# Altium schematic sheet 1_P1.schdoc
size 429 x 307 mm; Symbol: Drawing-Symbol_A4; Device: Drawing-Symbol_A4; Company: 嘉立创EDA; Version: V1.0; Page Size: A4; @Project Name: 最小系统版stm32f103; @Page Count: 1; @Update Date: 2025-07-18; @Create Date: 2025-07-12; @Schematic Name: Schematic1; @Page No: 1; @Page Name: P1; @Create Time: 23:24:22; @Update Time: 00:52:15; Width: 1655; Height: 1170; Region Start: 1; X Region Count: 6; Y Region Count: 4; Blade Width: 10; Title Block Position: 3; @Board Name: Board1; SheetNumber: 1; SheetTotal: 1
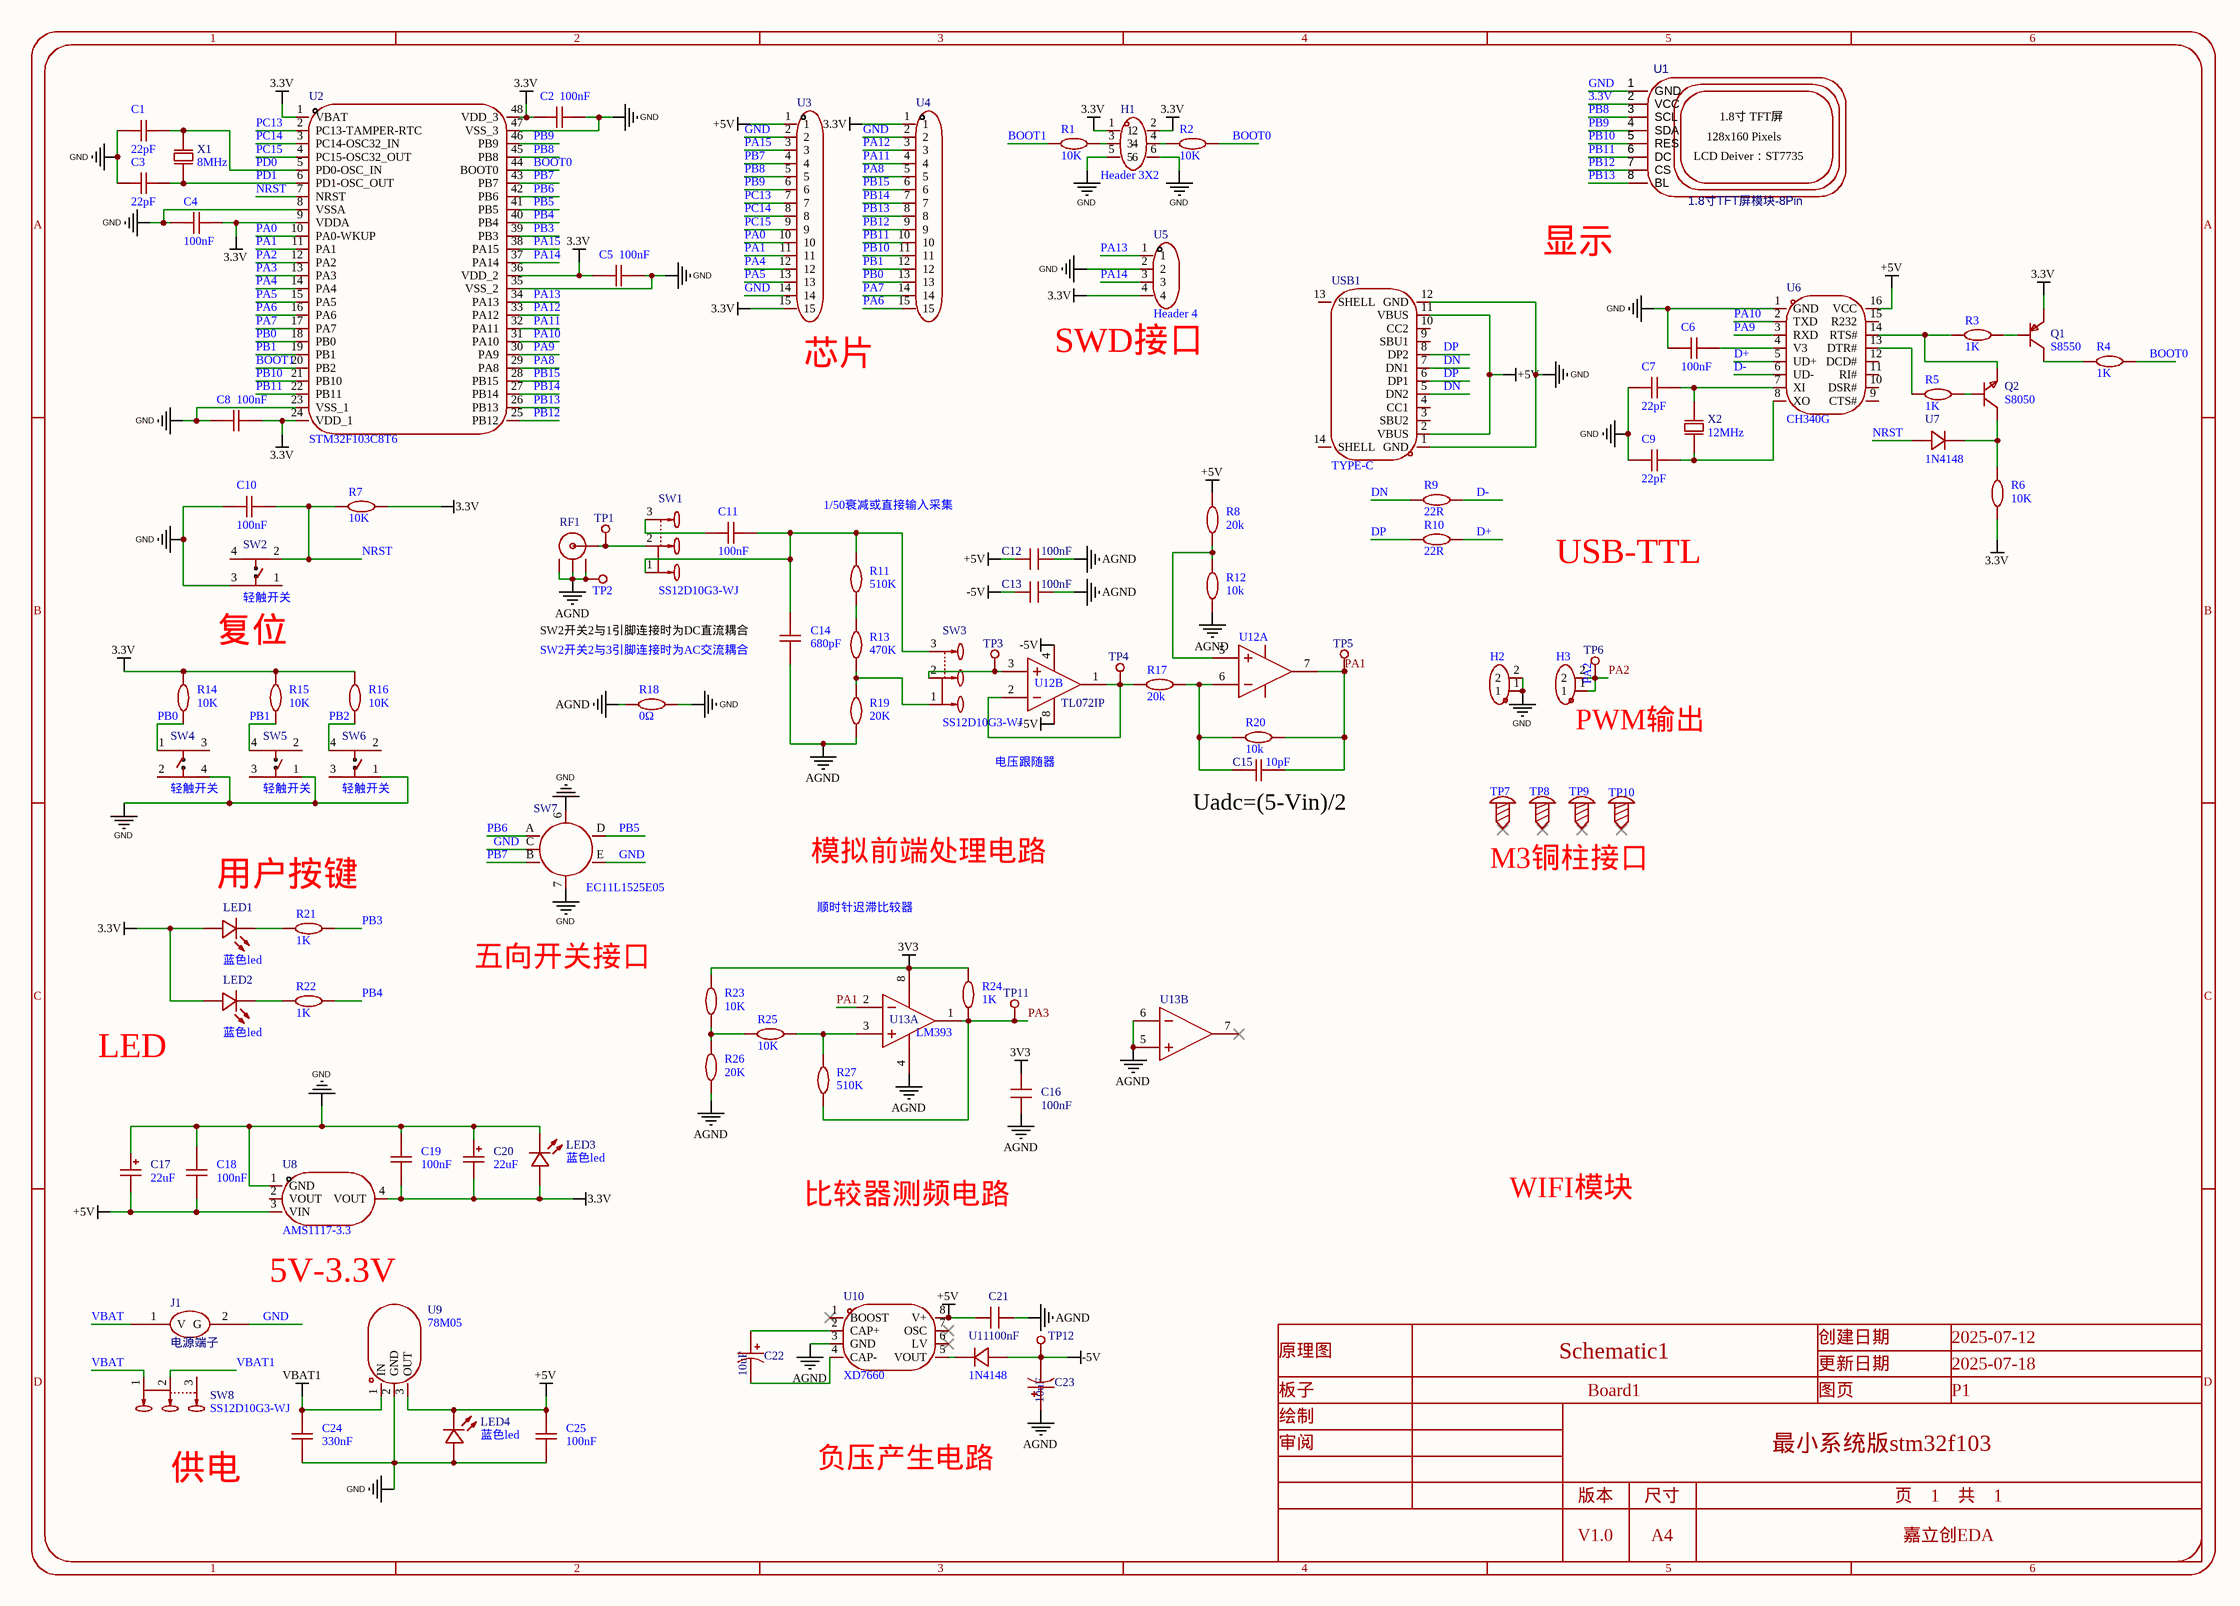
[diagram p0: 1_P1.schdoc]

## Parts
C1  22pF  [C0603]
C2  100nF  [C0603]
C3  22pF  [C0603]
C4  100nF  [C0603]
C5  100nF  [C0603]
C6  100nF  [C0603]
C7  22pF  [C0603]
C8  100nF  [C0603]
C9  22pF  [C0603]
C10  100nF  [C0603]
C11  100nF  [C0603]
C12  100nF  [C0603]
C13  100nF  [C0603]
C14  680pF  [C0603]
C15  10pF  [C0603]
C16  100nF  [C0603]
C17  22uF  [CAP-SMD_L2.0-W1.3-FD]
C18  100nF  [C0603]
C19  100nF  [C0603]
C20  22uF  [CAP-SMD_L2.0-W1.3-FD]
C21  100nF  [C0603]
C22  10uF  [CAP-SMD_L2.1-W1.4-FD]
C23  10uF  [CAP-SMD_L2.1-W1.4-FD]
C24  330nF  [C0603]
C25  100nF  [C0603]
H1  Header 3X2  [HDR-TH_6P-P2.54-V-M-R2-C3-S2.54]
H2  (no value)  [HDR-TH_2P-P2.54-V-M-1]
H3  (no value)  [HDR-TH_2P-P2.54-V-M-1]
J1  电源端子  [2.54-1x2p]
LED1  蓝色led  [LED0603-RD]
LED2  蓝色led  [LED0603-RD]
LED3  蓝色led  [LED0603-RD]
LED4  蓝色led  [LED0603-RD]
Q1  S8550  [SOT-23-3_L2.9-W1.3-P1.90-LS2.4-BR]
Q2  S8050  [SOT-23-3_L2.9-W1.3-P1.90-LS2.3-BR]
R1  10K  [R0603]
R2  10K  [R0603]
R3  1K  [R0603]
R4  1K  [R0603]
R5  1K  [R0603]
R6  10K  [R0603]
R7  10K  [R0603]
R8  20k  [R0603]
R9  22R  [R0603]
R10  22R  [R0603]
R11  510K  [R0603]
R12  10k  [R0603]
R13  470K  [R0603]
R14  10K  [R0603]
R15  10K  [R0603]
R16  10K  [R0603]
R17  20k  [R0603]
R18  0Ω  [R0603]
R19  20K  [R0603]
R20  10k  [R0603]
R21  1K  [R0603]
R22  1K  [R0603]
R23  10K  [R0603]
R24  1K  [R0603]
R25  10K  [R0603]
R26  20K  [R0603]
R27  510K  [R0603]
RF1  (no value)  [ANT-TH_KH-BNC75-3511]
SW1  SS12D10G3-WJ  [SW-TH_3P-P4.80_HX-SS12D10G3-WJ]
SW2  轻触开关  [SW-SMD_SH-6X6X4.5H-TP]
SW3  SS12D10G3-WJ  [SW-TH_3P-P4.80_HX-SS12D10G3-WJ]
SW4  轻触开关  [SW-SMD_SH-6X6X4.5H-TP]
SW5  轻触开关  [SW-SMD_SH-6X6X4.5H-TP]
SW6  轻触开关  [SW-SMD_SH-6X6X4.5H-TP]
SW7  EC11L1525E05  [SW-TH_EC11L1525E05]
SW8  SS12D10G3-WJ  [SW-TH_3P-P4.80_HX-SS12D10G3-WJ]
TP1  TP-黄色测试点  [TESTPOINT-TH_BD3.2]  (value not drawn)
TP2  TP-黄色测试点  [TESTPOINT-TH_BD3.2]  (value not drawn)
TP3  TP-黄色测试点  [TESTPOINT-TH_BD3.2]  (value not drawn)
TP4  TP-黄色测试点  [TESTPOINT-TH_BD3.2]  (value not drawn)
TP5  TP-黄色测试点  [TESTPOINT-TH_BD3.2]  (value not drawn)
TP6  TP-黄色测试点  [TESTPOINT-TH_BD3.2]  (value not drawn)
TP7  (no value)  [M3螺丝]
TP8  (no value)  [M3螺丝]
TP9  (no value)  [M3螺丝]
TP10  (no value)  [M3螺丝]
TP11  TP-黄色测试点  [TESTPOINT-TH_BD3.2]  (value not drawn)
TP12  TP-黄色测试点  [TESTPOINT-TH_BD3.2]  (value not drawn)
U1  1.8寸TFT屏模块-8Pin  [1.8寸TFT屏模块-8PIN]
U2  STM32F103C8T6  [LQFP-48_L7.0-W7.0-P0.50-LS9.0-BL]
U3  (no value)  [HDR-TH_15P-P2.54-V-M]
U4  (no value)  [HDR-TH_15P-P2.54-V-M]
U5  Header 4  [HDR-TH_4P-P2.54-V-M]
U6  CH340G  [SOIC-16_L9.9-W3.9-P1.27-LS6.0-BL]
U7  1N4148  [SMA_L4.3-W2.6-LS5.1-RD]
U8  AMS1117-3.3  [SOT-223-3_L6.5-W3.4-P2.30-LS7.0-BR]
U9  78M05  [TO-252-2_L6.6-W6.1-P4.57-LS9.9-BR-CW]
U10  XD7660  [DIP-8_L9.7-W6.4-P2.54-LS7.6-BL]
U11  1N4148  [SMA_L4.3-W2.6-LS5.1-RD]
U12  (no value)  [PDIP-8_L9.3-W6.4-P2.54-LS7.6-BL]  (parts A,B of 2)
U13  Manufacturer Part: LM393  [DIP-8_L10.1-W6.3-P2.54-LS7.6-BL-1]  (parts A,B of 2)
USB1  TYPE-C  [USB-C-SMD_TYPE-C-6PIN-2MD-073]
X1  8MHz  [OSC-TH_L10.0-W4.5-P5.00]
X2  12MHz  [HC-49US_L11.5-W4.5-P4.88]

## Nets
3.3V: C2.1 C4.1 C5.1 C8.2 C19.1 C20.2 H1.1 H1.2 LED1.2(+) LED2.2(+) LED3.2(+) Q1.2(E) R6.1 R7.2 R14.2 R15.2 R16.2 U1.2(VCC) U2.1(VBAT) U2.9(VDDA) U2.24(VDD_1) U2.36(VDD_2) U2.48(VDD_3) U3.15 U4.1 U5.4 U8.4(VOUT)
3V3: C16.1 R23.2 R24.2 U13.8(VCC)
+5V: C12.2 C17.2 C18.1 C21.1 C25.1 LED4.1(-) R8.1 U3.1 U6.16(VCC) U8.3(VIN) U9.3(OUT) U10.8(V+) U12.8(VCC+) USB1.2(VBUS) USB1.11(VBUS)
-5V: C13.2 C23.2 TP12.1 U11.2(A) U12.4(VCC-)
AGND: C12.1 C13.1 C14.2 C16.2 C21.2 C23.1 R12.2 R18.2 R19.1 R26.1 RF1.2 RF1.3 RF1.4 TP2.1 U10.3(GND) U13.4(GND) U13.5(2IN+) U13.6(2IN-)
GND: C1.1 C2.2 C3.1 C4.2 C5.2 C6.2 C7.1 C8.1 C9.1 C10.2 C17.1 C18.2 C19.2 C20.1 C24.2 C25.2 H1.5 H1.6 H2.1 H2.2 J1.2(G) LED3.1(-) LED4.2(+) R18.1 SW2.3 SW4.4 SW5.1 SW6.1 SW7.6(EH) SW7.7(EH) SW7.C SW7.E U1.1(GND) U2.8(VSSA) U2.23(VSS_1) U2.35(VSS_2) U2.47(VSS_3) U3.2 U3.14 U4.2 U5.2 U6.1(GND) U8.1(GND) U9.2(GND) USB1.1(GND) USB1.12(GND)
VBAT1: C24.1 SW8.2 U9.1(IN)
BOOT0: R2.2 R4.2 U2.44(BOOT0)
BOOT1: R1.1 U2.20(PB2)
D+: R10.2 U6.5(UD+)
D-: R9.2 U6.6(UD-)
DN: R9.1 USB1.5(DN2) USB1.7(DN1)
DP: R10.1 USB1.6(DP1) USB1.8(DP2)
NRST: C10.1 R7.1 SW2.2 U2.7(NRST) U7.2(A)
PA0: U2.10(PA0-WKUP) U3.10
PA1: C15.2 R20.2 TP5.1 U2.11(PA1) U3.11 U12.7(OUT2) U13.2(1IN-)
PA2: H3.1 H3.2 TP6.1 U2.12(PA2)
PA3: R24.1 R27.1 TP11.1 U2.13(PA3) U13.1(1OUT)
PA4: U2.14(PA4) U3.12
PA5: U2.15(PA5) U3.13
PA6: U2.16(PA6) U4.15
PA7: U2.17(PA7) U4.14
PA8: U2.29(PA8) U4.5
PA9: U2.30(PA9) U6.3(RXD)
PA10: U2.31(PA10) U6.2(TXD)
PA11: U2.32(PA11) U4.4
PA12: U2.33(PA12) U4.3
PA13: U2.34(PA13) U5.1
PA14: U2.37(PA14) U5.3
PA15: U2.38(PA15) U3.3
PB0: R14.1 SW4.1 U2.18(PB0) U4.13
PB1: R15.1 SW5.4 U2.19(PB1) U4.12
PB2: R16.1 SW6.4
PB3: R21.2 U2.39(PB3)
PB4: R22.2 U2.40(PB4)
PB5: SW7.D U2.41(PB5)
PB6: SW7.A U2.42(PB6)
PB7: SW7.B U2.43(PB7) U3.4
PB8: U1.3(SCL) U2.45(PB8) U3.5
PB9: U1.4(SDA) U2.46(PB9) U3.6
PB10: U1.5(RES) U2.21(PB10) U4.11
PB11: U1.6(DC) U2.22(PB11) U4.10
PB12: U1.7(CS) U2.25(PB12) U4.9
PB13: U1.8(BL) U2.26(PB13) U4.8
PB14: U2.27(PB14) U4.7
PB15: U2.28(PB15) U4.6
PC13: U2.2(PC13-TAMPER-RTC) U3.7
PC14: U2.3(PC14-OSC32_IN) U3.8
PC15: U2.4(PC15-OSC32_OUT) U3.9
PD0: C1.2 U2.5(PD0-OSC_IN) X1.1(OSC1)
PD1: C3.2 U2.6(PD1-OSC_OUT) X1.2(OSC2)
VBAT: J1.1(V) SW8.1
NetC6_1: C6.1 U6.4(V3)
NetC7_2: C7.2 U6.7(XI) X2.1(OSC1)
NetC9_2: C9.2 U6.8(XO) X2.2(OSC2)
NetC11_1: C11.1 C14.1 R11.2 SW1.1 SW3.3
NetC11_2: C11.2 SW1.3
NetC15_1: C15.1 R17.1 R20.1 U12.6(IN2-)
NetC22_1: C22.1 U10.2(CAP+)
NetC22_2: C22.2 U10.4(CAP-)
NetH1_3: H1.3 R1.2
NetH1_4: H1.4 R2.1
NetLED1_1: LED1.1(-) R21.1
NetLED2_1: LED2.1(-) R22.1
NetQ1_1: Q1.1(B) R3.2
NetQ1_3: Q1.3(C) R4.1
NetQ2_1: Q2.1(B) R5.2
NetQ2_2: Q2.2(E) R3.1 U6.14(RTS#)
NetQ2_3: Q2.3(C) R6.2 U7.1(K)
NetR5_1: R5.1 U6.13(DTR#)
NetR8_2: R8.2 R12.1 U12.5(IN2+)
NetR11_1: R11.1 R13.2
NetR13_1: R13.1 R19.2 SW3.1
NetR17_2: R17.2 TP4.1 U12.1(OUT1) U12.2(IN1-)
NetR23_1: R23.1 R25.2 R26.2
NetR25_1: R25.1 R27.2 U13.3(1IN+)
NetRF1_1: RF1.1(OUT) SW1.2 TP1.1
NetSW3_2: SW3.2 TP3.1 U12.3(IN1+)
NetU10_5: U10.5(VOUT) U11.1(K)

Not connected (* = marked no-connect by the designer): SW2 1 4; SW4 2 3; SW5 2 3; SW6 2 3; SW8 3; TP7 1*; TP8 1*; TP9 1*; TP10 1*; U6 9(CTS#) 10(DSR#) 11(RI#) 12(DCD#) 15(R232); U8 2(VOUT); U10 1(BOOST)* 6(LV)* 7(OSC)*; U13 7(2OUT)*; USB1 3(SBU2) 4(CC1) 9(SBU1) 10(CC2) 13(SHELL) 14(SHELL)

## Notes on the sheet
- 显示
- (near U3) 芯片
- (near U5) SWD接口
- 1/50衰减或直接输入采集
- USB-TTL
- SW2开关2与1引脚连接时为DC直流耦合
- 复位
- SW2开关2与3引脚连接时为AC交流耦合
- 电压跟随器
- (near H3) PWM输出
- (near C15) Uadc=(5-Vin)/2
- 用户按键
- 模拟前端处理电路
- M3铜柱接口
- 五向开关接口
- 顺时针迟滞比较器
- LED
- 比较器测频电路
- WIFI模块
- (near U8) 5V-3.3V
- 供电
- 负压产生电路
- 1
- 2
- 3
- 4
- 5
- 6
- A
- B
- C
- 原理图
- Schematic1
- 创建日期
- 更新日期
- 2025-07-12
- 2025-07-18
- D
- 板子
- 绘制
- Board1
- 图页
- P1
- 审阅
- 版本
- 尺寸
- 最小系统版stm32f103
- 页    1    共    1
- V1.0
- A4
- 嘉立创EDA
- (in symbol 1.8寸TFT屏模块-8Pin) 1.8寸 TFT屏; 128x160 Pixels; LCD Deiver：ST7735

## Library data of the parts
C1 C3 C7 C9 = CL10C220JB8NNNC: Manufacturer: SAMSUNG(三星); Symbol: CapAcitance; Add into BOM: yes; Tolerance: ±5%; Voltage Rated: 50V; Temperature Coefficient: C0G; Device: CL10C220JB8NNNC; LCSC Part Name: 22pF ±5% 50V; Supplier Part: C1653; Manufacturer Part: CL10C220JB8NNNC; Supplier Footprint: 0603; JLCPCB Part Class: Basic Part; Datasheet: https://atta.szlcsc.com/upload/public/pdf/source/20160218/1457707763339.pdf; Supplier: LCSC; Convert to PCB: yes; Value: 22pF
C2 C4-C6 C8 C10 C11 C14 C18 C19 C25 = CAP_0603: Symbol: CapAcitance; Convert to PCB: yes; Device: CAP_0603; Add into BOM: yes; Supplier Footprint: 0603
  C2 C4-C6 C8 C10 C11 C18 C19 C25: Value: 100nF
  C14: Value: 680pF
C12 C13 C16 C21 = CGA0603X7R104K500JT: Manufacturer: HRE(芯声); Symbol: CT4-0805B104K500F1; Add into BOM: yes; Tolerance: ±10%; Voltage Rating: 50V; Temperature Coefficient: X7R; Device: CGA0603X7R104K500JT; LCSC Part Name: 100nF ±10% 50V; Supplier Part: C6119867; Manufacturer Part: CGA0603X7R104K500JT; Supplier Footprint: 0603; JLCPCB Part Class: Extended Part; Datasheet: https://atta.szlcsc.com/upload/public/pdf/source/20250103/C44077DA9E7B3EFAE02F22B6D3D1CBC9.pdf; Supplier: LCSC; Convert to PCB: yes; Value: 100nF
C15 = CL10C100JB8NNNC: Manufacturer: SAMSUNG(三星); Symbol: N06A1B100KN0B0S0N0; Add into BOM: yes; Tolerance: ±5%; Voltage Rated: 50V; Temperature Coefficient: C0G; Device: CL10C100JB8NNNC; LCSC Part Name: 10pF ±5% 50V; Supplier Part: C1634; Manufacturer Part: CL10C100JB8NNNC; Supplier Footprint: 0603; JLCPCB Part Class: Basic Part; Datasheet: https://atta.szlcsc.com/upload/public/pdf/source/20160218/1457707763339.pdf; Supplier: LCSC; Convert to PCB: yes; Value: 10pF
C17 C20 = TLJR226M010R3800: Manufacturer: Kyocera AVX; Symbol: TAJA226K010RNJ; Add into BOM: yes; Tolerance: ±20%; Voltage Rated: 10V; Equivalent Series Resistance(ESR): 3.8Ω; Device: TLJR226M010R3800; LCSC Part Name: 22uF ±20% 10V; Supplier Part: C1954754; Manufacturer Part: TLJR226M010R3800; Supplier Footprint: 0805; JLCPCB Part Class: Extended Part; Datasheet: https://atta.szlcsc.com/upload/public/pdf/source/20210703/8B69E0E679BE21BB8A360EF7A68B4CB4.pdf; Supplier: LCSC; Convert to PCB: yes; Value: 22uF; Leakage Current(DCL): -; Ripple Current: -; Operating Temperature: -55℃~+125℃
C22 C23 = TAJP106M010RNJ: Manufacturer: Kyocera AVX; Symbol: 01EC1809SHC10UF50V; Add into BOM: yes; Tolerance: ±20%; Voltage Rated: 10V; Equivalent Series Resistance(ESR): 6Ω; Device: TAJP106M010RNJ; Supplier: LCSC; Supplier Part: C1952866; Manufacturer Part: TAJP106M010RNJ; Value: 10uF; JLCPCB Part Class: Extended Part; LCSC Part Name: 10uF ±20% 10V; Supplier Footprint: 0805; Datasheet: https://atta.szlcsc.com/upload/public/pdf/source/20200508/C528414_E7647BF5233468AE8B10D12AED045AE0.pdf; Convert to PCB: yes; Current - Leakage: -; Ripple Current: -; Operating Temperature: -55℃~+125℃
C24 = CC0603KRX7R8BB334: Manufacturer: YAGEO(国巨); Symbol: CapAcitance; Add into BOM: yes; Tolerance: ±10%; Voltage Rated: 25V; Temperature Coefficient: X7R; Device: CC0603KRX7R8BB334; LCSC Part Name: 330nF ±10% 25V; Supplier Part: C107070; Manufacturer Part: CC0603KRX7R8BB334; Supplier Footprint: 0603; JLCPCB Part Class: Extended Part; Datasheet: https://atta.szlcsc.com/upload/public/pdf/source/20180910/C282072_33301C7F631E79921B82A8DAC6BCC5B3.pdf; Supplier: LCSC; Convert to PCB: yes; Value: 330nF
H1 = PZ254V-12-6P: Manufacturer: XFCN(兴飞); Add into BOM: yes; Pin Structure: 2x3P; Pitch: 2.54mm; Circluar Pins/Square Pins: 方针; Symbol: PZ254V-12-6P; Device: PZ254V-12-6P; LCSC Part Name: 间距:2.54mm 2x3P 直插 方针; Supplier Part: C492420; Manufacturer Part: Header 3X2; Supplier Footprint: 插件,P=2.54mm; JLCPCB Part Class: 扩展库; Datasheet: https://atta.szlcsc.com/upload/public/pdf/source/20200309/C492420_BAECB307B001054C09D200388220EAE6.pdf; Supplier: LCSC; Convert to PCB: yes; Row Spacing: 2.54mm; Mounting Type: 直插; Number of Rows: 双排; Number of Pins: 6P; Current Rating (Max): -; Voltage Rating (Max): -; Length of Mating Pin: 6mm; Insulation Height: 2.5mm; Length of End Connection Pin: 3mm; Contact Material: 黄铜; Contact Plating: -; Operating Temperature Range: -40℃~+105℃; Color: 黑色
H2 H3 = HDR-M_2.54_1x2P: Symbol: 210S-1*2P L=11.6MMGold-plated black; Convert to PCB: yes; Device: HDR-M_2.54_1x2P; Add into BOM: yes; Supplier Part: C124375; Supplier Footprint: 插件
J1 = 电源端子: Add into BOM: yes; Symbol: 电源端子; Device: 电源端子; Convert to PCB: yes; Origin Footprint: 2.54-1x2p; Design Item ID: 电源端子; Library Name: wk
LED1-LED4 = LTST-C190KSKT: Manufacturer: LITEON(光宝); Add into BOM: yes; Emitted Color: 黄色; Forward Voltage (VF): 2.1V; Power Dissipation: 75mW; Forward Current: 20mA; Dominant Wavelength: 584.5nm~597nm; Peak Wavelength: 588nm; Lens Color: 无色透明透镜; Luminous Intensity: 104mcd; Viewing Angle: 130°; Symbol: LTST-C190KSKT; Device: LTST-C190KSKT; LCSC Part Name: 黄灯; Supplier Part: C125095; Manufacturer Part: 蓝色led; Supplier Footprint: 0603; JLCPCB Part Class: 扩展库; Datasheet: https://atta.szlcsc.com/upload/public/pdf/source/20180129/C125095_15171881843821315881.pdf; Supplier: LCSC; Convert to PCB: yes; Diode Configuration: -; Color Temperature: -; Mounting Sytle: -; Operating Temperature: -30℃~+85℃
Q1 = S8550_C20069126: Manufacturer: 宏嘉诚; Add into BOM: yes; type: PNP; Current - Collector(Ic): 500mA; Collector - Emitter Voltage VCEO: 25V; Pd - Power Dissipation: 300mW; DC Current Gain: 120@500mA,1.0V; Transition frequency(fT): 150MHz; Current - Collector Cutoff: 100nA; Vce Saturation(VCE(sat)): 500mV; Symbol: S8550_C20069126; Device: S8550_C20069126; LCSC Part Name: hFE:200-350，丝印:2TY S8550; Supplier Part: C20069126; Manufacturer Part: S8550; Supplier Footprint: SOT-23; JLCPCB Part Class: 扩展库; Datasheet: https://atta.szlcsc.com/upload/public/pdf/source/20250107/6DAD7E9AA702AA129A4A0106BAAB5F5A.pdf; Supplier: LCSC; Convert to PCB: yes; Operating Temperature: -55℃~+150℃
Q2 = S8050_C20069125: Manufacturer: 宏嘉诚; Add into BOM: yes; type: NPN; Current - Collector(Ic): 500mA; Collector - Emitter Voltage VCEO: 25V; Pd - Power Dissipation: 300mW; DC Current Gain: 120@50mA,1.0V; Transition frequency(fT): 100MHz; Current - Collector Cutoff: 100nA; Vce Saturation(VCE(sat)): 600mV; Symbol: S8050_C20069125; Device: S8050_C20069125; LCSC Part Name: hFE:200-350，丝印:J3Y S8050; Supplier Part: C20069125; Manufacturer Part: S8050; Supplier Footprint: SOT-23; JLCPCB Part Class: 扩展库; Datasheet: https://atta.szlcsc.com/upload/public/pdf/source/20250107/343E8B94B5C24D0D65D7D4B70E0B73F6.pdf; Supplier: LCSC; Convert to PCB: yes; Operating Temperature: -55℃~+150℃
R1-R27 = Res_0603: Symbol: 电阻; Convert to PCB: yes; Device: Res_0603; Add into BOM: yes; Supplier Footprint: 0603
  R1 R2 R6 R7 R14-R16 R23 R25: Value: 10K
  R3-R5 R21 R22 R24: Value: 1K
  R8 R17: Value: 20k
  R9 R10: Value: 22R
  R11 R27: Value: 510K
  R12 R20: Value: 10k
  R13: Value: 470K
  R18: Value: 0Ω
  R19 R26: Value: 20K
RF1 = KH-BNC75-3511: Manufacturer: kinghelm(金航标); Add into BOM: yes; Connector Type: 板端; RF Series: BNC; Interface Type: 内孔; Number of Ports: 1; Impedance: 75Ω; Frequency-Max: 3GHz; Style: 弯头; Interface Diameter: 9.5mm; Symbol: KH-BNC75-3511; Device: KH-BNC75-3511; LCSC Part Name: BNC 内孔 弯头; Supplier Part: C2837587; Manufacturer Part: KH-BNC75-3511; Supplier Footprint: 插件; JLCPCB Part Class: Extended Part; Datasheet: https://atta.szlcsc.com/upload/public/pdf/source/20210608/C2837588_F39E24707EBCDC367432B410E607DF01.pdf; Supplier: LCSC; Convert to PCB: yes; Interface Length/Height: -; Operating Temperature Range: -55~+155
SW1 SW3 SW8 = SS12D10G3-WJ: Manufacturer: SHOU HAN(首韩); Symbol: SS-12D10L5; Add into BOM: yes; Circuit: 单刀双掷; Switch Length: 12.7mm; Switch Width: 6.7mm; Current Rating (DC): 2A; Voltage Rating (DC): 125V; Mechanical Life: 3千次; Device: SS12D10G3-WJ; LCSC Part Name: 两档卧式插件 3脚拨动开关弯插 柄长3.0mm; Supplier Part: C7431056; Manufacturer Part: SS12D10G3-WJ; Supplier Footprint: 插件; JLCPCB Part Class: Extended Part; Datasheet: https://atta.szlcsc.com/upload/public/pdf/source/20230621/84EB0BBB436606EF3B83C38A13C3295C.pdf; Supplier: LCSC; Convert to PCB: yes; Mounting Style: 直插; Operating Temperature: -25℃~+70℃
SW2 SW4-SW6 = SH-6X6X5H-TP: Manufacturer: SHOU HAN(首韩); Add into BOM: yes; Symbol: SH-6X6X5H-TP; Device: SH-6X6X5H-TP; LCSC Part Name: 6*6/6x6 轻触开关; Supplier Part: C42416254; Manufacturer Part: 轻触开关; Supplier Footprint: SMD-4P,6x6mm; JLCPCB Part Class: 扩展库; Datasheet: https://atta.szlcsc.com/upload/public/pdf/source/20250103/936B092E53F0D152C46176A6F02D2A6B.pdf; Supplier: LCSC; Convert to PCB: yes
SW7 = EC11L1525E05: Manufacturer: ALPSALPINE(阿尔卑斯阿尔派); Add into BOM: yes; Symbol: EC11L1525E05; Device: EC11L1525E05; LCSC Part Name: 编码器 停产; Supplier Part: C2687298; Manufacturer Part: EC11L1525E05; Supplier Footprint: 插件; JLCPCB Part Class: Extended Part; Datasheet: https://atta.szlcsc.com/upload/public/pdf/source/20210222/C2687298_D85F935961A23A0DB1B474C7A2A10B19.pdf; Supplier: LCSC; Convert to PCB: yes
TP1-TP6 TP11 TP12 = TP-黄色测试点: Add into BOM: no; Convert to PCB: yes; Symbol: TP-黄色测试点; Device: TP-黄色测试点; LCSC Part Name: TP-黄色测试点; Supplier Part: C9900007422; Manufacturer Part: TP-黄色测试点; Supplier Footprint: TESTPOINT-TH_BD-2P-P2.00; JLCPCB Part Class: 扩展库; Datasheet: https://atta.szlcsc.comnull; Supplier: LCSC
TP7-TP10 = M3螺丝: Symbol: 螺丝孔; Convert to PCB: yes; Add into BOM: no; Device: M3螺丝; Supplier Footprint: 插件
U1 = 1.8寸TFT屏模块-8Pin: Convert to PCB: yes; Symbol: 1.8寸TFT屏模块-8Pin; Device: 1.8寸TFT屏模块-8Pin; Supplier Part: C2897371; Supplier: 立创商城; Add into BOM: yes; Origin Footprint: 1.8寸TFT屏模块-8PIN
U2 = STM32F103C8T6: Manufacturer: ST(意法半导体); Add into BOM: yes; CPU Core: ARM-M3; CPU Maximum Speed: 72MHz; Program Storage Size: 64KB; Program Memory Type: FLASH; Number of I/O: 37; ADC (Bit): 12bit; Voltage - Supply: 2V~3.6V; Symbol: STM32F103C8T6; Device: STM32F103C8T6; LCSC Part Name: 主流增强型ARM Cortex-M3 MCU，具有64 KB Flash、72 MHz CPU、电机控制、USB和CAN; Supplier Part: C8734; Manufacturer Part: STM32F103C8T6; Supplier Footprint: LQFP-48(7x7); JLCPCB Part Class: 扩展库; Datasheet: https://atta.szlcsc.com/upload/public/pdf/source/20220812/8363ACEC51AD55ECEB84799464F7CB85.pdf; Supplier: LCSC; Convert to PCB: yes; Applications: -
U3 U4 = ZX-PZ2.54-1-15PZZ: Manufacturer: Megastar(兆星); Add into BOM: yes; Pin Structure: 1x15P; Pitch: 2.54mm; Circluar Pins/Square Pins: 方针; Current Rating: 3A; Symbol: ZX-PZ2.54-1-15PZZ; Device: ZX-PZ2.54-1-15PZZ; LCSC Part Name: 1x15P 间距:2.54mm 方针 直插; Supplier Part: C7501269; Supplier Footprint: 插件,P=2.54mm; JLCPCB Part Class: 扩展库; Datasheet: https://atta.szlcsc.com/upload/public/pdf/source/20231122/A1A587BCB61FD4E661A7B23F28C6B7B8.pdf; Supplier: LCSC; Convert to PCB: yes; Row Spacing: -; Mounting Type: 直插; Number of Rows: 单排; Number of Pins: 15P; Voltage Rating (Max): -; Length of Mating Pin: 6mm; Insulation Height: 2.5mm; Length of End Connection Pin: 3mm; Contact Material: 黄铜; Contact Plating: 金; Operating Temperature: -40℃~+105℃; Color: 黑色
U5 = ZX-PZ2.54-1-4PZZ: Manufacturer: Megastar(兆星); Add into BOM: yes; Pin Structure: 1x4P; Pitch: 2.54mm; Circluar Pins/Square Pins: 方针; Current Rating: 3A; Symbol: ZX-PZ2.54-1-4PZZ; Device: ZX-PZ2.54-1-4PZZ; LCSC Part Name: 1x4P 间距:2.54mm 方针 直插; Supplier Part: C7501262; Manufacturer Part: Header 4; Supplier Footprint: 插件,P=2.54mm; JLCPCB Part Class: 扩展库; Datasheet: https://atta.szlcsc.com/upload/public/pdf/source/20231122/4E787E5D6BDB0EA5477973D5EC6E573B.pdf; Supplier: LCSC; Convert to PCB: yes; Row Spacing: -; Mounting Type: 直插; Number of Rows: 单排; Number of Pins: 4P; Voltage Rating (Max): -; Length of Mating Pin: 6mm; Insulation Height: 2.5mm; Length of End Connection Pin: 3mm; Contact Material: 黄铜; Contact Plating: 金; Operating Temperature: -40℃~+105℃; Color: 黑色
U6 = CH340G: Manufacturer: WCH(南京沁恒); Add into BOM: yes; Applications Function: USB转UART; Protocol: USB 2.0; Supply Voltage: 5V；3.3V; Data Rate: 2Mbps; Symbol: CH340G; Device: CH340G; LCSC Part Name: USB转串口芯片CH340; Supplier Part: C14267; Manufacturer Part: CH340G; Supplier Footprint: SOP-16; JLCPCB Part Class: 扩展库; Datasheet: https://atta.szlcsc.com/upload/public/pdf/source/20240313/8510303D24D987FBF1AD30058571F10E.pdf; Supplier: LCSC; Convert to PCB: yes; Operating Temperature: -40℃~+85℃
U7 U11 = 1N4007: Symbol: 1N4007_C9900004759; Add into BOM: yes; Device: 1N4007; LCSC Part Name: 1N4007; Supplier Part: C9900004759; Manufacturer Part: 1N4148; Supplier Footprint: SMA_L4.3-W2.6-LS5.1-RD; JLCPCB Part Class: Extended Part; Supplier: LCSC; Convert to PCB: yes
U8 = AMS1117-3.3_C6186: Manufacturer: AMS; Add into BOM: yes; Output Type: 固定; Voltage - Supply: 16V; Output Voltage: 3.3V; Output Current: 1A; Power Supply Rejection Ratio (PSRR): 72dB@(120Hz); Voltage Dropout: 1.1V@(800mA); standby current: 5mA; Output Configuration: 正极; Number of Outputs: 1; Symbol: AMS1117-3.3; Device: AMS1117-3.3_C6186; LCSC Part Name: 输出3.3V 1A; Supplier Part: C6186; Manufacturer Part: AMS1117-3.3; Supplier Footprint: SOT-223; JLCPCB Part Class: 基础库; Datasheet: https://atta.szlcsc.com/upload/public/pdf/source/20180727/C6186_7A095716F0823C02F1997A905E26C086.pdf; Supplier: LCSC; Convert to PCB: yes; Noise: -; Features: 过流保护；过热保护; Operating Temperature: -40℃~+125℃
U9 = 78M05_C347278: Manufacturer: UMW(友台半导体); Symbol: UMW78M05; Add into BOM: yes; Output Type: 固定; Voltage - Supply: 35V; Output Voltage: 5V; Output Current: 1A; Power Supply Rejection Ratio (PSRR): 80dB@(120Hz); Voltage Dropout: 2V@(500mA); standby current: 6mA; Output Configuration: 正极; Number of Outputs: 1; Device: 78M05_C347278; LCSC Part Name: 输入35V 输出5V; Supplier Part: C347278; Manufacturer Part: 78M05; Supplier Footprint: TO-252; JLCPCB Part Class: 扩展库; Datasheet: https://atta.szlcsc.com/upload/public/pdf/source/20250624/2ED28F9D7FF713C883D8BAA10D92504A.pdf; Supplier: LCSC; Convert to PCB: yes; Features: 短路保护；过热保护; Operating Temperature: -20℃~+85℃
U10 = XD7660: Manufacturer: XINLUDA(信路达); Add into BOM: yes; Symbol: XD7660; Device: XD7660; LCSC Part Name: XD7660; Supplier Part: C521200; Manufacturer Part: XD7660; Supplier Footprint: DIP-8; JLCPCB Part Class: 扩展库; Datasheet: https://atta.szlcsc.com/upload/public/pdf/source/20211222/A10DD3C2ED176FBA4174F4F58C348BA3.pdf; Supplier: LCSC; Convert to PCB: yes
U12 = TL072IP: Manufacturer: TI(德州仪器); Add into BOM: yes; Number of Circuits: 2; Gain Bandwidth Product(GBP): 3MHz; Slew Rate(SR): 13V/us; Supply Current Per Channel: 1.4mA; Symbol: TL072IP; Device: TL072IP; LCSC Part Name: TL072IP; Supplier Part: C110329; Manufacturer Part: TL072IP; Supplier Footprint: PDIP-8; JLCPCB Part Class: 扩展库; Datasheet: https://atta.szlcsc.com/upload/public/pdf/source/20170919/C110329_1505787021678976659.pdf; Supplier: LCSC; Convert to PCB: yes; Operating Temperature: -40℃~+85℃
U13 = LM393P: Manufacturer: HGSEMI(华冠); Add into BOM: yes; Number of Elements: 2; Supply Voltage（Single）: 2V~36V,±1V~18V; Iq per channel (Typ): 2.5mA; Output Type: CMOS, MOS, Open-Collector, TTL; Symbol: LM393P; Device: LM393P; LCSC Part Name: LM393P; Supplier Part: C725322; Supplier Footprint: DIP-8; JLCPCB Part Class: 扩展库; Datasheet: https://atta.szlcsc.com/upload/public/pdf/source/20120424/1457706480158.pdf; Supplier: LCSC; Convert to PCB: yes; Propagation Delay (Max): -; Operating Temperature: 0°C ~ 70°C
USB1 = TYPE-C 16PIN 2MD(073): Manufacturer: SHOU HAN(首韩); Add into BOM: yes; Protocol Standard: USB 3.1; Gender: 母; Number of Contacts: 16P; Number of Ports: 1; Current Rating-Power: 3A; Voltage Rating: 5V; Connect-Disconnect Life: 5千次; Detection color: 黑色; Symbol: TYPE-C 16PIN 2MD(073); Device: TYPE-C 16PIN 2MD(073); LCSC Part Name: Type-C 母 卧贴; Supplier Part: C2765186; Manufacturer Part: TYPE-C; Supplier Footprint: SMD; JLCPCB Part Class: 扩展库; Datasheet: https://atta.szlcsc.com/upload/public/pdf/source/20250506/FFB74EDFDFA0AC372CE4A8E4F739CCEF.pdf; Supplier: LCSC; Convert to PCB: yes; Connector Type: Type-C; Mounting Type: 卧贴; Supplementary Features: -; Center Height: -; Length: -; Operating Temperature: -25℃~+85℃
X1 = X49SD8MSD2SC: Manufacturer: YXC(扬兴晶振); Add into BOM: yes; Normal temperature Frequency Tolerance: ±20ppm; Load Capacitance: 20pF; Frequency Stability: ±30ppm; Symbol: X49SD8MSD2SC; Device: X49SD8MSD2SC; LCSC Part Name: HC-49US 8MHZ 2P 49S 20PF ±20PPM -20~70℃ (±30PPM); Supplier Part: C21263; Manufacturer Part: X49SD8MSD2SC; Supplier Footprint: HC-49S; JLCPCB Part Class: 扩展库; Datasheet: https://atta.szlcsc.com/upload/public/pdf/source/20240329/977D7F2434F98B2BE33270BB9FF3D86D.pdf; Supplier: LCSC; Convert to PCB: yes; Type: 直插晶振; Value: 8MHz; Operating Temperature: -20℃~+70℃
X2 = X49SD12MSD2SC: Manufacturer: YXC(扬兴晶振); Symbol: X49SD8MSD2SC; Add into BOM: yes; Normal temperature Frequency Tolerance: ±20ppm; Load Capacitance: 20pF; Frequency Stability: ±30ppm; Device: X49SD12MSD2SC; LCSC Part Name: HC-49US 12MHZ 2P 49S 20PF ±20PPM -20~70℃（±30PPM）; Supplier Part: C16369; Manufacturer Part: X49SD12MSD2SC; Supplier Footprint: HC-49S; JLCPCB Part Class: Extended Part; Datasheet: https://atta.szlcsc.com/upload/public/pdf/source/20240329/977D7F2434F98B2BE33270BB9FF3D86D.pdf; Supplier: LCSC; Convert to PCB: yes; Type: 直插晶振; Value: 12MHz; Operating Temperature: -20℃~+70℃